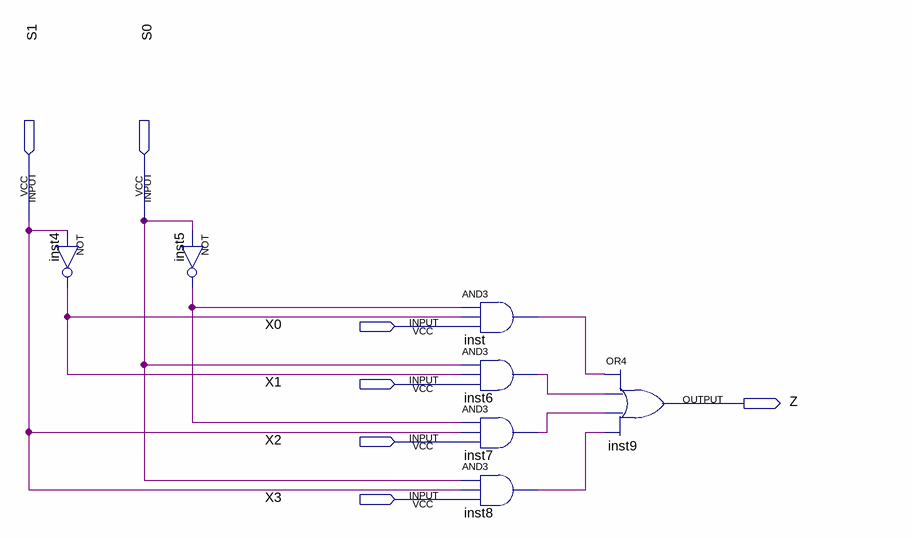
[diagram p0: schematic sheet]
// Quartus schematic Comply.bdf as structural Verilog: 7 symbols, 7 pins
module Comply (
  input  S1,
  input  S0,
  input  X0,
  input  X1,
  input  X2,
  input  X3,
  output Z
);

  wire inst4_out, inst5_out, inst6_out, inst7_out, inst8_out, inst_out;

  not inst4 (inst4_out, S1);
  not inst5 (inst5_out, S0);
  and inst (inst_out, inst5_out, inst4_out, X0);
  and inst6 (inst6_out, S0, inst4_out, X1);
  and inst7 (inst7_out, inst5_out, S1, X2);
  and inst8 (inst8_out, S0, S1, X3);
  or inst9 (Z, inst_out, inst6_out, inst7_out, inst8_out);
endmodule
